# Altium schematic sheet SheetArduinoPNP.SchDoc
size A4
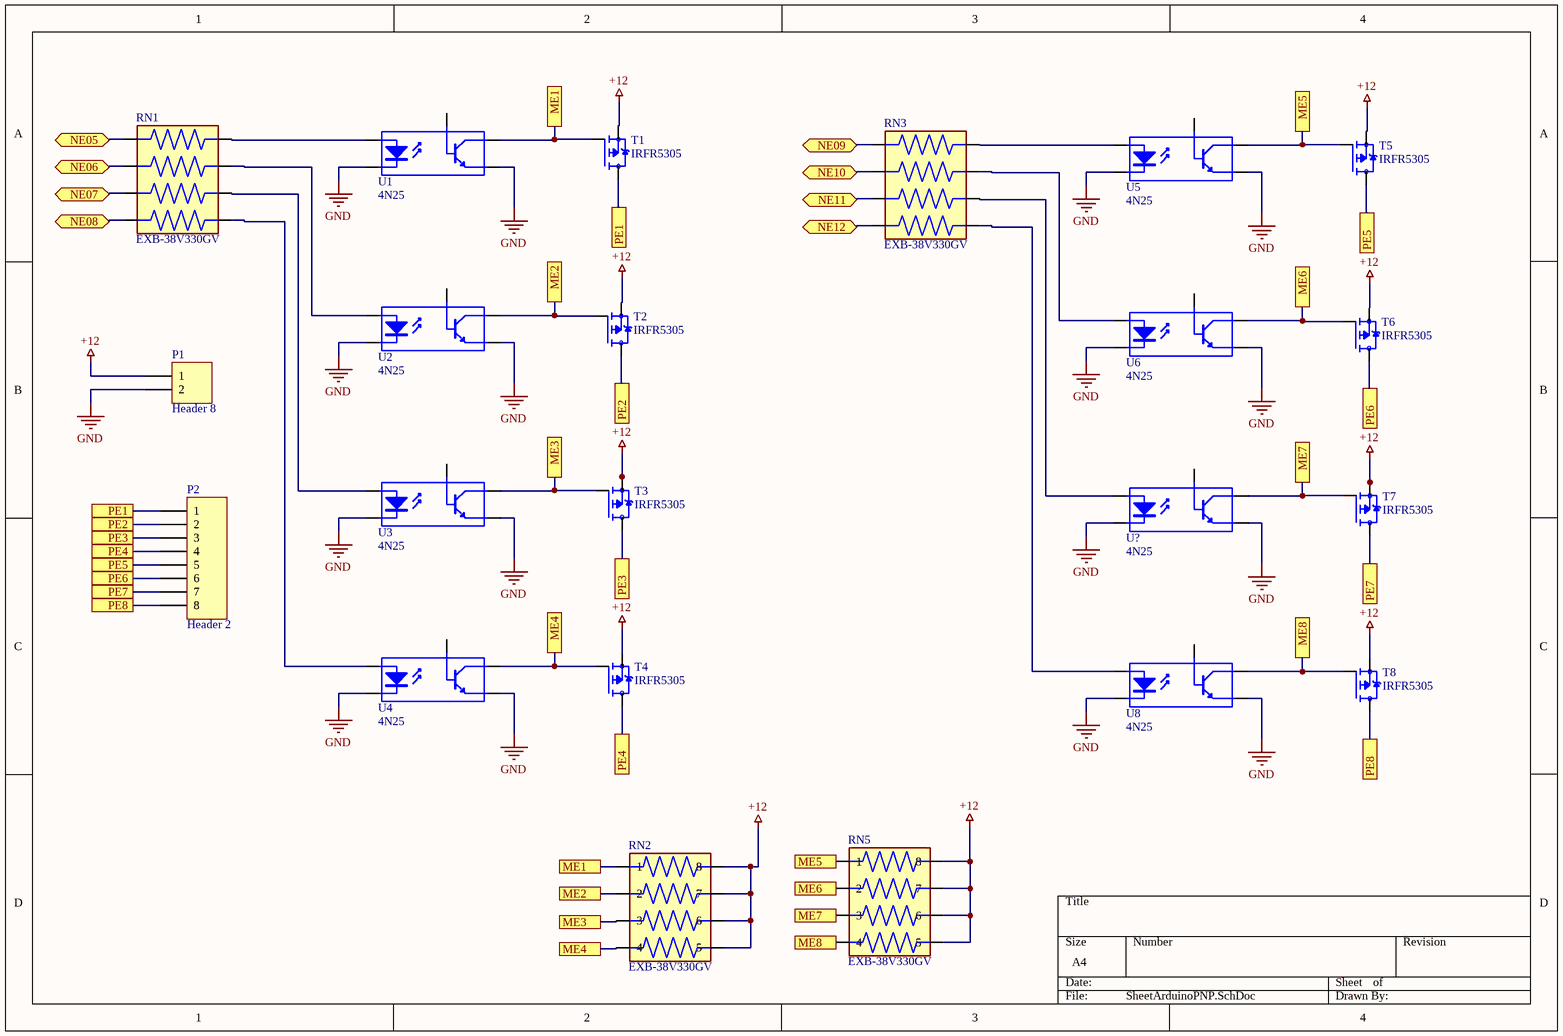
[diagram p0: SheetArduinoPNP.SchDoc]

## Parts
P1  Header 8  [HDR1X2]
P2  Header 2  [HDR1X8]
RN1  EXB-38V330GV  [RESCAXS80P320X160X60-8N]
RN2  EXB-38V330GV  [RESCAXS80P320X160X60-8N]
RN3  EXB-38V330GV  [RESCAXS80P320X160X60-8N]
RN5  EXB-38V330GV  [RESCAXS80P320X160X60-8N]
T1  IRFR5305  [D-PAK_TO252AA]
T2  IRFR5305  [D-PAK_TO252AA]
T3  IRFR5305  [D-PAK_TO252AA]
T4  IRFR5305  [D-PAK_TO252AA]
T5  IRFR5305  [D-PAK_TO252AA]
T6  IRFR5305  [D-PAK_TO252AA]
T7  IRFR5305  [D-PAK_TO252AA]
T8  IRFR5305  [D-PAK_TO252AA]
U1  4N25  [SOP5(6)]
U2  4N25  [SOP5(6)]
U3  4N25  [SOP5(6)]
U4  4N25  [SOP5(6)]
U5  4N25  [SOP5(6)]
U6  4N25  [SOP5(6)]
U8  4N25  [SOP5(6)]
U?  4N25  [SOP5(6)]

## Ports
ME1, ME2, ME3, ME4, ME5, ME6, ME7, ME8, NE05 (bidir), NE06 (bidir), NE07 (bidir), NE08 (bidir), NE09 (bidir), NE10 (bidir), NE11 (bidir), NE12 (bidir), PE1, PE2, PE3, PE4, PE5, PE6, PE7, PE8

## Nets
+12: P1.1 RN2.5 RN2.6 RN2.7 RN2.8 RN5.5 RN5.6 RN5.7 RN5.8 T1.3(S) T2.3(S) T3.3(S) T4.3(S) T5.3(S) T6.3(S) T7.3(S) T8.3(S)
GND: P1.2 U1.3(K) U1.4(E) U2.3(K) U2.4(E) U3.3(K) U3.4(E) U4.3(K) U4.4(E) U5.3(K) U5.4(E) U6.3(K) U6.4(E) U8.3(K) U8.4(E) U?.3(K) U?.4(E)
ME1: RN2.1 T1.1(G) U1.1(A) ; port ME1
ME2: RN2.2 T2.1(G) U2.1(A) ; port ME2
ME3: RN2.3 T3.1(G) U3.5(C) ; port ME3
ME4: RN2.4 T4.1(G) U4.1(A) ; port ME4
ME5: RN5.1 T5.1(G) U5.1(A) ; port ME5
ME6: RN5.2 T6.1(G) U6.1(A) ; port ME6
ME7: RN5.3 T7.1(G) U?.1(A) ; port ME7
ME8: RN5.4 T8.1(G) U8.1(A) ; port ME8
NE05: RN1.1 ; port NE05
NE06: RN1.2 ; port NE06
NE07: RN1.3 ; port NE07
NE08: RN1.4 ; port NE08
NE09: RN3.1 ; port NE09
NE10: RN3.2 ; port NE10
NE11: RN3.3 ; port NE11
NE12: RN3.4 ; port NE12
PE1: P2.1 T1.4(D) ; port PE1
PE2: P2.2 T2.4(D) ; port PE2
PE3: P2.3 T3.4(D) ; port PE3
PE4: P2.4 T4.4(D) ; port PE4
PE5: P2.5 T5.4(D) ; port PE5
PE6: P2.6 T6.4(D) ; port PE6
PE7: P2.7 T7.4(D) ; port PE7
PE8: P2.8 T8.4(D) ; port PE8
NetRN1_5: RN1.5 U4.5(C)
NetRN1_6: RN1.6 U3.5(C)
NetRN1_7: RN1.7 U2.5(C)
NetRN1_8: RN1.8 U1.5(C)
NetRN3_5: RN3.5 U8.5(C)
NetRN3_6: RN3.6 U?.5(C)
NetRN3_7: RN3.7 U6.5(C)
NetRN3_8: RN3.8 U5.5(C)

Not connected (* = marked no-connect by the designer): U1 6(B); U2 6(B); U3 6(B); U4 6(B); U5 6(B); U6 6(B); U8 6(B); U? 6(B)

## Library data of the parts
P1 = Header 2: Header, 2-Pin; LatestRevisionDate: 17-Jul-2002; LatestRevisionNote: Re-released for DXP Platform.; Publisher: Altium Limited
P2 = Header 8: Header, 8-Pin; LatestRevisionDate: 17-Jul-2002; LatestRevisionNote: Re-released for DXP Platform.; Publisher: Altium Limited
RN1-RN3 RN5 = EXB-38V330GV: Resistor Array, Chip, 4 elements CONVEX 1206 2%; MF: Panasonic; SnapEDA_Link: https://www.snapeda.com/parts/EXB-38V330GV/Panasonic/view-part/1421932/?ref=snap; Price: None; MP: EXB-38V330GV; Package: 0603 Panasonic; Value: *; Check_prices: https://www.snapeda.com/parts/EXB-38V330GV/Panasonic/view-part/1421932/?ref=eda; Availability: Bad
T1-T8 = IRFR5305: P-Channel 55V 31A _Tc_ 110W _Tc_ Surface Mount D-Pak; MF: Infineon Technologies; Availability: Unavailable; Value: *; Package: TO-252-3 Infineon Technologies; Price: None; SnapEDA_Link: https://www.snapeda.com/parts/IRFR5305/Infineon%20Technologies/view-part/2877715/?ref=snap; MP: IRFR5305
U1-U6 U8 U? = Optoisolator2: 5 Pin Mini Flat Pack Optocoupler; Published: 24-Mar-1999; LatestRevisionDate: 04-Mar-2005; LatestRevisionNote: PCB Footprint replaced, Sch pins re-numbered.; DatasheetVersion: Apr-2004; PackageReference: SOP5(6); Publisher: Altium Limited; PackageDescription: Small Outline; 6 Leads (1 Absent); Body Width 4.4 mm; Pitch 1.27 mm